# Altium schematic sheet ui_board_interconnect.SchDoc
size A4
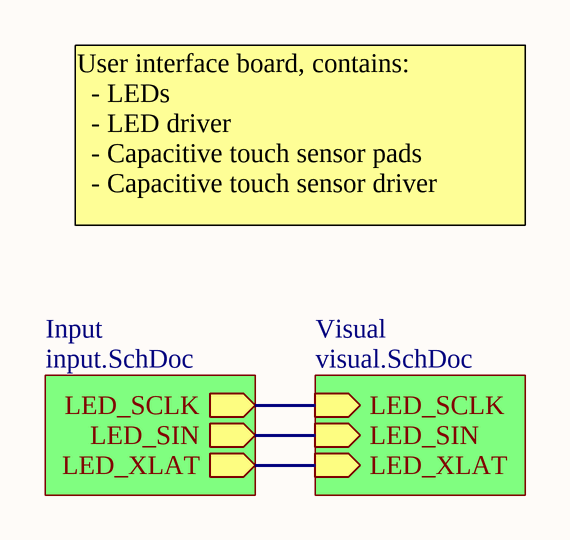
[diagram p0: ui_board_interconnect.SchDoc]

## Sub-sheets
Input = input.SchDoc: LED_SCLK (out), LED_SIN (out), LED_XLAT (out)
Visual = visual.SchDoc: LED_SCLK (in), LED_SIN (in), LED_XLAT (in)

## Nets
(unnamed): sheet Input/LED_SCLK, sheet Visual/LED_SCLK
(unnamed): sheet Input/LED_SIN, sheet Visual/LED_SIN
(unnamed): sheet Input/LED_XLAT, sheet Visual/LED_XLAT

## Notes on the sheet
- User interface board, contains:
  - LEDs
  - LED driver
  - Capacitive touch sensor pads
  - Capacitive touch sensor driver